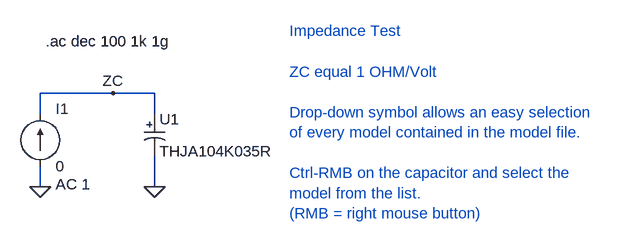
[diagram p0: schematic avx_tantalum_lib_drop-down1.asc]
avx_tantalum_lib_drop-down1.asc, the LTspice schematic file:
Version 4
SHEET 1 1116 680
WIRE 272 96 160 96
WIRE 336 96 272 96
WIRE 160 128 160 96
WIRE 336 128 336 96
WIRE 160 240 160 208
WIRE 336 240 336 192
FLAG 160 240 0
FLAG 336 240 0
FLAG 272 96 ZC
SYMBOL current 160 208 M180
WINDOW 0 24 88 Left 0
WINDOW 3 24 0 Left 0
WINDOW 123 24 -28 Left 0
WINDOW 39 0 0 Left 0
SYMATTR InstName I1
SYMATTR Value 0
SYMATTR Value2 AC 1
SYMBOL avx_tantalum_d 320 128 R0
SYMATTR InstName U1
TEXT 168 16 Left 0 !.ac dec 100 1k 1g
TEXT 544 0 Left 0 ;Impedance Test\n \nZC equal 1 OHM/Volt\n \nDrop-down symbol allows an easy selection \nof every model contained in the model file.\n \nCtrl-RMB on the capacitor and select the \nmodel from the list.\n(RMB = right mouse button)

The netlist it stands for:
* avx_tantalum_lib_drop-down1.asc
I1 0 ZC 0 AC 1
XU1 ZC 0 THJA104K035R THJA104K035R  ; pins A B
.ac dec 100 1k 1g
* Impedance Test
* ZC equal 1 OHM/Volt
* Drop-down symbol allows an easy selection
* of every model contained in the model file.
* Ctrl-RMB on the capacitor and select the
* model from the list.
* (RMB = right mouse button)
.lib AVX_TANTALUM.lib
.backanno
.end